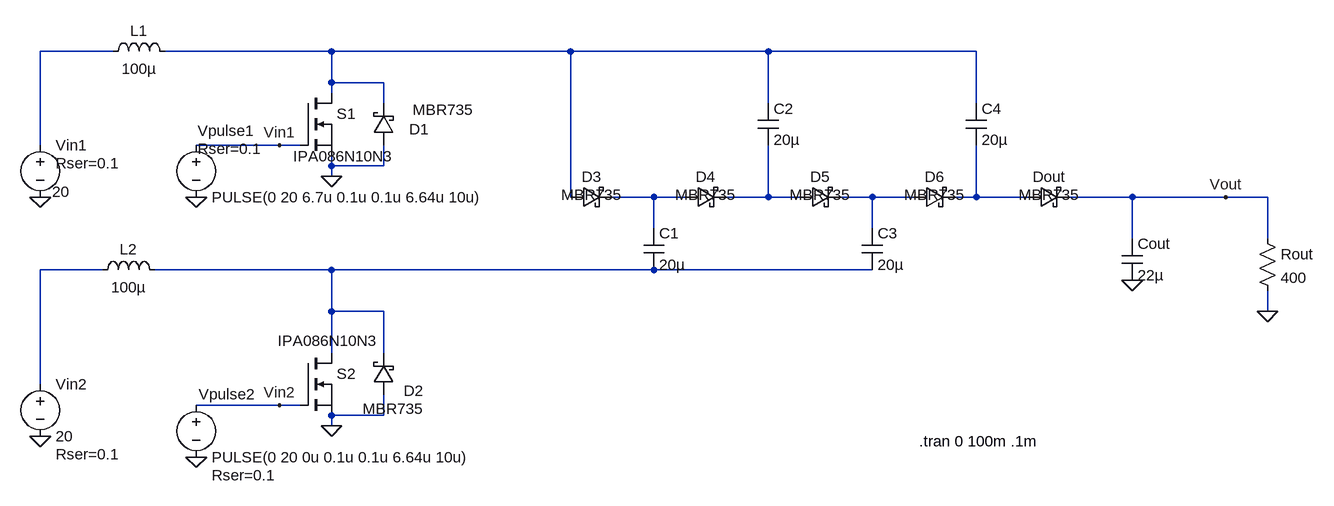
[diagram p0: schematic DC_DC converter.asc]
DC_DC converter.asc, the LTspice schematic file:
Version 4
SHEET 1 1456 680
WIRE -928 -368 -1040 -368
WIRE -592 -368 -848 -368
WIRE -224 -368 -592 -368
WIRE 80 -368 -224 -368
WIRE 400 -368 80 -368
WIRE -592 -320 -592 -368
WIRE -512 -320 -592 -320
WIRE -592 -304 -592 -320
WIRE -512 -288 -512 -320
WIRE 80 -288 80 -368
WIRE 400 -288 400 -368
WIRE -1040 -224 -1040 -368
WIRE -672 -224 -800 -224
WIRE -640 -224 -672 -224
WIRE -592 -192 -592 -208
WIRE -512 -192 -512 -224
WIRE -512 -192 -592 -192
WIRE -592 -176 -592 -192
WIRE -224 -144 -224 -368
WIRE -96 -144 -160 -144
WIRE -48 -144 -96 -144
WIRE 80 -144 80 -224
WIRE 80 -144 16 -144
WIRE 128 -144 80 -144
WIRE 240 -144 192 -144
WIRE 304 -144 240 -144
WIRE 400 -144 400 -224
WIRE 400 -144 368 -144
WIRE 480 -144 400 -144
WIRE 640 -144 544 -144
WIRE 784 -144 640 -144
WIRE 848 -144 784 -144
WIRE -96 -96 -96 -144
WIRE 240 -96 240 -144
WIRE 640 -80 640 -144
WIRE 848 -80 848 -144
WIRE -944 -32 -1040 -32
WIRE -592 -32 -864 -32
WIRE -96 -32 -592 -32
WIRE 240 -32 -96 -32
WIRE -592 32 -592 -32
WIRE -512 32 -592 32
WIRE 848 32 848 0
WIRE -592 96 -592 32
WIRE -512 96 -512 32
WIRE -1040 144 -1040 -32
WIRE -672 176 -800 176
WIRE -640 176 -672 176
WIRE -512 192 -512 160
WIRE -512 192 -592 192
WIRE -592 208 -592 192
FLAG -592 -176 0
FLAG -592 208 0
FLAG -800 -144 0
FLAG -800 256 0
FLAG -1040 224 0
FLAG -1040 -144 0
FLAG 640 -16 0
FLAG -672 -224 Vin1
FLAG -672 176 Vin2
FLAG 784 -144 Vout
FLAG 848 32 0
SYMBOL voltage -1040 -240 R0
WINDOW 3 18 88 Left 2
WINDOW 123 0 0 Left 0
WINDOW 39 24 44 Left 2
SYMATTR Value 20
SYMATTR SpiceLine Rser=0.1
SYMATTR InstName Vin1
SYMBOL voltage -800 -240 R0
WINDOW 0 2 -6 Left 2
WINDOW 123 0 0 Left 0
WINDOW 39 2 22 Left 2
SYMATTR InstName Vpulse1
SYMATTR SpiceLine Rser=0.1
SYMATTR Value PULSE(0 20 6.7u 0.1u 0.1u 6.64u 10u)
SYMBOL voltage -1040 128 R0
WINDOW 123 0 0 Left 0
WINDOW 39 24 124 Left 2
SYMATTR SpiceLine Rser=0.1
SYMATTR InstName Vin2
SYMATTR Value 20
SYMBOL voltage -800 160 R0
WINDOW 0 4 -1 Left 2
WINDOW 123 0 0 Left 0
WINDOW 39 24 124 Left 2
SYMATTR InstName Vpulse2
SYMATTR SpiceLine Rser=0.1
SYMATTR Value PULSE(0 20 0u 0.1u 0.1u 6.64u 10u)
SYMBOL ind -944 -352 R270
WINDOW 0 32 56 VTop 2
WINDOW 3 5 56 VBottom 2
SYMATTR InstName L1
SYMATTR Value 100µ
SYMATTR SpiceLine Ipk=0 Rser=0 Rpar=0 Cpar=0
SYMBOL schottky -496 -224 R180
WINDOW 0 -54 24 Left 2
WINDOW 3 -123 54 Left 2
SYMATTR InstName D1
SYMATTR Value MBR735
SYMATTR Description Diode
SYMATTR Type diode
SYMBOL schottky -496 160 R180
WINDOW 0 -46 6 Left 2
WINDOW 3 -46 -22 Left 2
SYMATTR InstName D2
SYMATTR Value MBR735
SYMATTR Description Diode
SYMATTR Type diode
SYMBOL schottky -224 -128 R270
WINDOW 0 32 32 VTop 2
WINDOW 3 4 32 VTop 2
SYMATTR InstName D3
SYMATTR Value MBR735
SYMATTR Description Diode
SYMATTR Type diode
SYMBOL schottky -48 -128 R270
WINDOW 0 32 32 VTop 2
WINDOW 3 4 32 VTop 2
SYMATTR InstName D4
SYMATTR Value MBR735
SYMATTR Description Diode
SYMATTR Type diode
SYMBOL schottky 128 -128 R270
WINDOW 0 32 32 VTop 2
WINDOW 3 4 32 VTop 2
SYMATTR InstName D5
SYMATTR Value MBR735
SYMATTR Description Diode
SYMATTR Type diode
SYMBOL schottky 304 -128 R270
WINDOW 0 32 32 VTop 2
WINDOW 3 4 32 VTop 2
SYMATTR InstName D6
SYMATTR Value MBR735
SYMATTR Description Diode
SYMATTR Type diode
SYMBOL schottky 480 -128 R270
WINDOW 0 32 32 VTop 2
WINDOW 3 4 32 VTop 2
SYMATTR InstName Dout
SYMATTR Value MBR735
SYMATTR Description Diode
SYMATTR Type diode
SYMBOL cap -112 -96 R0
SYMATTR InstName C1
SYMATTR Value 20µ
SYMATTR SpiceLine V=16 Irms=0 Rser=0 Lser=0 mfg="Murata" pn="GRMJN7R61C206ME05" type="X5R"
SYMBOL cap 64 -288 R0
SYMATTR InstName C2
SYMATTR Value 20µ
SYMATTR SpiceLine V=16 Irms=0 Rser=0 Lser=0 mfg="Murata" pn="GRMJN7R61C206ME05" type="X5R"
SYMBOL cap 224 -96 R0
SYMATTR InstName C3
SYMATTR Value 20µ
SYMATTR SpiceLine V=16 Irms=0 Rser=0 Lser=0 mfg="Murata" pn="GRMJN7R61C206ME05" type="X5R"
SYMBOL cap 384 -288 R0
SYMATTR InstName C4
SYMATTR Value 20µ
SYMATTR SpiceLine V=16 Irms=0 Rser=0 Lser=0 mfg="Murata" pn="GRMJN7R61C206ME05" type="X5R"
SYMBOL res 832 -96 R0
SYMATTR InstName Rout
SYMATTR Value 400
SYMBOL nmos -640 -304 R0
WINDOW 3 -11 97 Left 2
SYMATTR Value IPA086N10N3
SYMATTR InstName S1
SYMBOL nmos -640 96 R0
WINDOW 3 -35 -19 Left 2
SYMATTR Value IPA086N10N3
SYMATTR InstName S2
SYMBOL cap 624 -80 R0
SYMATTR InstName Cout
SYMATTR Value 22µ
SYMATTR SpiceLine V=16 Irms=0 Rser=0 Lser=0
SYMBOL ind -960 -16 R270
WINDOW 0 32 56 VTop 2
WINDOW 3 5 56 VBottom 2
SYMATTR InstName L2
SYMATTR Value 100µ
SYMATTR SpiceLine Ipk=0 Rser=0 Rpar=0 Cpar=0
TEXT 312 232 Left 2 !.tran 0 100m .1m

The netlist it stands for:
* DC_DC converter.asc
Vin1 N001 0 20 Rser=0.1
Vpulse1 Vin1 0 PULSE(0 20 6.7u 0.1u 0.1u 6.64u 10u) Rser=0.1
Vin2 N007 0 20 Rser=0.1
Vpulse2 Vin2 0 PULSE(0 20 0u 0.1u 0.1u 6.64u 10u) Rser=0.1
L1 N001 N002 100µ Ipk=0 Rser=0 Rpar=0 Cpar=0
D1 0 N002 MBR735
D2 0 N008 MBR735
D3 N002 N003 MBR735
D4 N003 N004 MBR735
D5 N004 N005 MBR735
D6 N005 N006 MBR735
Dout N006 Vout MBR735
C1 N003 N008 20µ V=16 Irms=0 Rser=0 Lser=0 mfg="Murata" pn="GRMJN7R61C206ME05" type="X5R"
C2 N002 N004 20µ V=16 Irms=0 Rser=0 Lser=0 mfg="Murata" pn="GRMJN7R61C206ME05" type="X5R"
C3 N005 N008 20µ V=16 Irms=0 Rser=0 Lser=0 mfg="Murata" pn="GRMJN7R61C206ME05" type="X5R"
C4 N002 N006 20µ V=16 Irms=0 Rser=0 Lser=0 mfg="Murata" pn="GRMJN7R61C206ME05" type="X5R"
Rout Vout 0 400
M§S1 N002 Vin1 0 0 IPA086N10N3
M§S2 N008 Vin2 0 0 IPA086N10N3
Cout Vout 0 22µ V=16 Irms=0 Rser=0 Lser=0
L2 N007 N008 100µ Ipk=0 Rser=0 Rpar=0 Cpar=0
.model D D
.lib standard.dio
.model NMOS NMOS
.model PMOS PMOS
.lib standard.mos
.tran 0 100m .1m
.backanno
.end